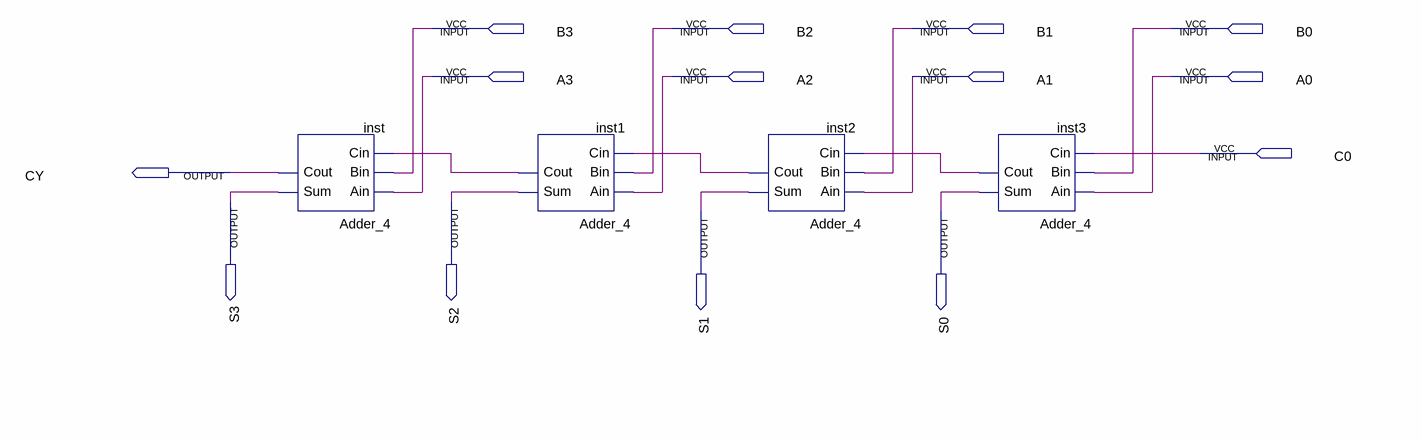
[diagram p0: schematic sheet]
// Quartus schematic Full_Adder4.bdf as structural Verilog: 4 symbols, 14 pins
module Full_Adder4 (
  input  B3,
  input  B2,
  input  B1,
  input  B0,
  input  A3,
  input  A2,
  input  A1,
  input  A0,
  input  C0,
  output CY,
  output S3,
  output S2,
  output S1,
  output S0
);

  wire inst1_cout, inst2_cout, inst3_cout;

  Adder_4 inst (.Ain(A3), .Bin(B3), .Cin(inst1_cout), .Sum(S3), .Cout(CY));
  Adder_4 inst1 (.Ain(A2), .Bin(B2), .Cin(inst2_cout), .Sum(S2), .Cout(inst1_cout));
  Adder_4 inst2 (.Ain(A1), .Bin(B1), .Cin(inst3_cout), .Sum(S1), .Cout(inst2_cout));
  Adder_4 inst3 (.Ain(A0), .Bin(B0), .Cin(C0), .Sum(S0), .Cout(inst3_cout));
endmodule
